# Altium project triumvi_v10_phoneJeck_charging.PrjPcb
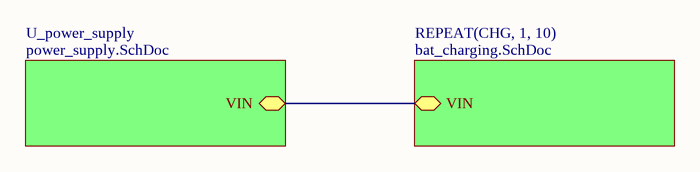
[diagram p0: top.SchDoc]
3 sheets, 88 parts. Net scope: hierarchical (ports join the sheet entries above them; power ports are global).
Board files: triumvi_v10_phoneJack_charging.PcbDoc, triumvi_v10_phoneJack_charging_arr.PcbDoc
Sheets:
  top.SchDoc
    CHG1 = bat_charging.SchDoc
    CHG2 = bat_charging.SchDoc
    CHG3 = bat_charging.SchDoc
    CHG4 = bat_charging.SchDoc
    CHG5 = bat_charging.SchDoc
    CHG6 = bat_charging.SchDoc
    CHG7 = bat_charging.SchDoc
    CHG8 = bat_charging.SchDoc
    CHG9 = bat_charging.SchDoc
    CHG10 = bat_charging.SchDoc
    U_power_supply = power_supply.SchDoc

## Sheet top.SchDoc
size Letter; Author: Ye-Sheng Kuo; Organization: Altium Limited; Address1: L3, 12a Rodborough Rd; Address2: Frenchs Forest; Address3: NSW; Address4: Australia 2086; Revision: 1

### Sub-sheets
REPEAT(CHG, 1, 10) = bat_charging.SchDoc: VIN
U_power_supply = power_supply.SchDoc: VIN

### Nets
NetC1_CHG1_1: sheet REPEAT(CHG, 1, 10)/VIN, sheet U_power_supply/VIN

### Notes on the sheet
- Title
- Date:
- Author:
- Revision:
- Sheet
- of
- University of Michigan
- File:

## Sheet bat_charging.SchDoc
size Letter; Author: Ye-Sheng Kuo; Organization: Altium Limited; Address1: L3, 12a Rodborough Rd; Address2: Frenchs Forest; Address3: NSW; Address4: Australia 2086; Revision: 1
Used 10 times, as channels CHG1, CHG2, CHG3, CHG4, CHG5, CHG6, CHG7, CHG8, CHG9, CHG10. Parts and nets are listed once, with the designators drawn on the sheet.
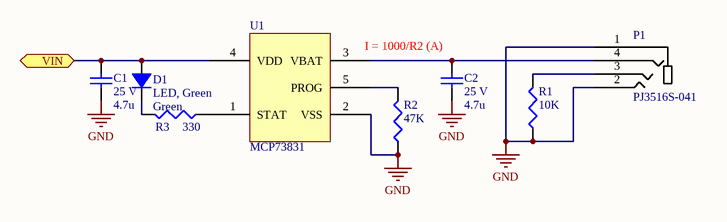
[diagram p1: bat_charging.SchDoc]

### Parts
C1  value 4.7u  voltage rated: 25 V  [0805]  (hidden comment: Ceramic capacitor)
C2  value 4.7u  voltage rated: 25 V  [0805]  (hidden comment: Ceramic capacitor)
D1  LED, Green  Color: Green  [0603 - LED]
P1  PJ3516S-041  [PJ3516S-041]
R1  value 10K  [0603]  (hidden comment: Chip resistor)
R2  value 47K  [0603]  (hidden comment: Chip resistor)
R3  value 330  [0603]  (hidden comment: Chip resistor)
U1  MCP73831  [TSOT23-5]

### Ports
VIN

### Nets
GND: C1.2 C2.2 P1.1 P1.2 R1.2 R2.2 U1.2(VSS)
VIN: C1.1 D1.1 U1.4(VDD) ; port VIN
NetC2_1: C2.1 P1.4 U1.3(VBAT)
NetD1_2: D1.2 R3.1
NetP1_3: P1.3 R1.1
NetR2_1: R2.1 U1.5(PROG)
NetR3_2: R3.2 U1.1(STAT)

### Channels
CHG1: designators end in _CHG1; ports VIN=NetC1_CHG1_1
CHG2: designators end in _CHG2; ports VIN=NetC1_CHG1_1
CHG3: designators end in _CHG3; ports VIN=NetC1_CHG1_1
CHG4: designators end in _CHG4; ports VIN=NetC1_CHG1_1
CHG5: designators end in _CHG5; ports VIN=NetC1_CHG1_1
CHG6: designators end in _CHG6; ports VIN=NetC1_CHG1_1
CHG7: designators end in _CHG7; ports VIN=NetC1_CHG1_1
CHG8: designators end in _CHG8; ports VIN=NetC1_CHG1_1
CHG9: designators end in _CHG9; ports VIN=NetC1_CHG1_1
CHG10: designators end in _CHG10; ports VIN=NetC1_CHG1_1

### Notes on the sheet
- I = 1000/R2 (A)
- Title
- Date:
- Author:
- Revision:
- Sheet
- of
- University of Michigan
- File:

### Library data of the parts
C1 C2 = C_4.7u_25V_0805_ceramic: Ceramic capacitor, 4.7 uF, 25 V, 0805 package; Manufacture: Murata; tolerance: 10%; Temperature Coefficient: X5R; package: 0805; Supplier 1: Digi-Key; Supplier Part Number 1: 490-3335-1-ND
D1 = D_LED_GREEN_0603: LED, Green,  0603; package: 0603; Supplier 1: Digi-Key; Supplier Part Number 1: 160-1446-1-ND
P1 = PJ3516S-041: 3.5 mm phone jack, 4 terminals
R1 = R_10K_0603: Chip resistor, 10K, 0603 package; tolerance: 1%; power: 1/10 W; package: 0603; Supplier 1: Digi-Key; Supplier Part Number 1: 541-10.0KHCT-ND
R2 = R_47K_0603: Chip resistor, 47K, 0603 package; tolerance: 1%; power: 1/10 W; package: 0603; Supplier 1: Digi-Key; Supplier Part Number 1: 541-47.0KHCT-ND
R3 = R_330_0603: Chip resistor, 330, 0603 package; tolerance: 1%; power: 1/10 W; package: 0603; Supplier 1: Digi-Key; Supplier Part Number 1: 541-330HCT-ND
U1 = MCP73831: Miniature Single-Cell, Fully Integrated Li-Ion,  Li-Polymer Charge Management Controllers; Supplier 1: Digi-Key; Supplier Part Number 1: MCP73831T-2ATI/OTCT-ND

## Sheet power_supply.SchDoc
size Letter; Author: Ye-Sheng Kuo; Organization: Altium Limited; Address1: L3, 12a Rodborough Rd; Address2: Frenchs Forest; Address3: NSW; Address4: Australia 2086; Revision: 1
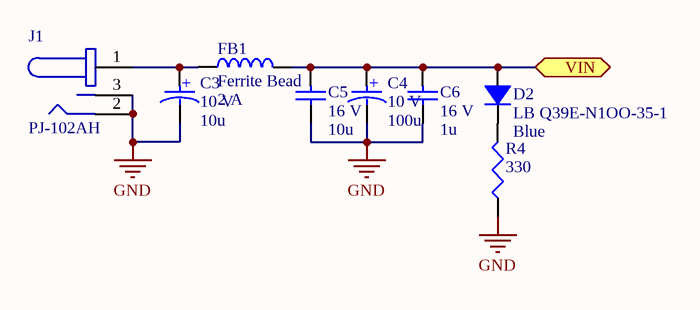
[diagram p2: power_supply.SchDoc]

### Parts
C3  value 10u  voltage rated: 10 V  [0603 - Polar Marking]  (hidden comment: Tantalum capacitor)
C4  value 100u  voltage rated: 10 V  [2917]  (hidden comment: Ceramic capacitor)
C5  value 10u  voltage rated: 16 V  [0603]  (hidden comment: Ceramic capacitor)
C6  value 1u  voltage rated: 16 V  [0603]  (hidden comment: Ceramic capacitor)
D2  LB Q39E-N1OO-35-1  Color: Blue  [0603 - LED]
FB1  Ferrite Bead  current rating: 2 A  [0603]
J1  PJ-102AH  [PJ-102AH]
R4  value 330  [0603]  (hidden comment: Chip resistor)

### Ports
VIN

### Nets
GND: C3.2 C4.2 C5.2 C6.2 J1.2 J1.3 R4.2
NetC1_CHG1_1: C4.1 C5.1 C6.1 D2.1 FB1.1 ; port VIN
NetC3_1: C3.1 FB1.2 J1.1
NetD2_2: D2.2 R4.1

### Notes on the sheet
- Title
- Date:
- Author:
- Revision:
- Sheet
- of
- University of Michigan
- File:
- (in symbol C_10u_10V_0603_tantalum) +
- (in symbol C_100u_10V_2917_tantalum) +

### Library data of the parts
C3 = C_10u_10V_0603_tantalum: Tantalum capacitor, 10 uF, 10 V, 0603 package; Manufacture: Rohm Semiconductor; tolerance: 10%; ESR: 9 Ω; package: 0603; Supplier 1: Digi-Key; Supplier Part Number 1: 511-1679-1-ND
C4 = C_100u_10V_2917_tantalum: Tantalum capacitor, 100u, 2917 package; Manufacture: Kemet; tolerance: 10%; package: 2917; Supplier 1: Digi-Key; Supplier Part Number 1: 399-3769-1-ND
C5 = C_10u_16V_0603_ceramic: Ceramic capacitor, 10 uF, 16 V, 0603 package; Manufacture: TDK; tolerance: 20%; Temperature Coefficient: X5R; package: 0603; Supplier 1: Digi-Key; Supplier Part Number 1: 445-9065-1-ND
C6 = C_1u_16V_0603_ceramic: Ceramic capacitor, 1 uF, 16 V, 0603 package; Manufacture: TDK; tolerance: 10%; package: 0603; Supplier 1: Digi-Key; Supplier Part Number 1: 445-1604-1-ND
D2 = D_LED_Blue_0603: LED, Blue, 0603; package: 0603; Supplier 1: Digi-Key; Supplier Part Number 1: 475-2815-1-ND
FB1 = FB_2A_0603: Ferrite Bead, 2 A, 0603 package; DC resistance: 50 m; package: 0603; Supplier 1: Digi-Key; Supplier Part Number 1: 553-2387-1-ND
J1 = PJ-102AH: CONN PWR JACK 2.1X5.5MM HIGH CUR; Supplier 1: Digi-Key; Supplier Part Number 1: CP-102AH-ND
R4 = R_330_0603: as R3 on sheet bat_charging; package: 0603; Supplier 1: Digi-Key; Supplier Part Number 1: 541-330HCT-ND

## Nets that join several sheets
GND: CHG1 (7 pins), CHG2 (7 pins), CHG3 (7 pins), CHG4 (7 pins), CHG5 (7 pins), CHG6 (7 pins), CHG7 (7 pins), CHG8 (7 pins), CHG9 (7 pins), CHG10 (7 pins), power_supply (7 pins)
NetC1_CHG1_1: CHG1 (C1_CHG1.1 D1_CHG1.1 U1_CHG1.4), CHG2 (C1_CHG2.1 D1_CHG2.1 U1_CHG2.4), CHG3 (C1_CHG3.1 D1_CHG3.1 U1_CHG3.4), CHG4 (C1_CHG4.1 D1_CHG4.1 U1_CHG4.4), CHG5 (C1_CHG5.1 D1_CHG5.1 U1_CHG5.4), CHG6 (C1_CHG6.1 D1_CHG6.1 U1_CHG6.4), CHG7 (C1_CHG7.1 D1_CHG7.1 U1_CHG7.4), CHG8 (C1_CHG8.1 D1_CHG8.1 U1_CHG8.4), CHG9 (C1_CHG9.1 D1_CHG9.1 U1_CHG9.4), CHG10 (C1_CHG10.1 D1_CHG10.1 U1_CHG10.4), power_supply (5 pins)